# EasyEDA Pro project LUME_PEN_EasyEDA_Project_V1.2_2026-06-28.epro, schematic Schematic4
Board Name: 03_Debug_Board; Create Date: 2026-05-27; Page Name: P1; Project Name: LUME; Schematic Name: Schematic4; Update Date: 2026-06-01; Company: EasyEDA.com; Page Size: A4; Version: V1.0
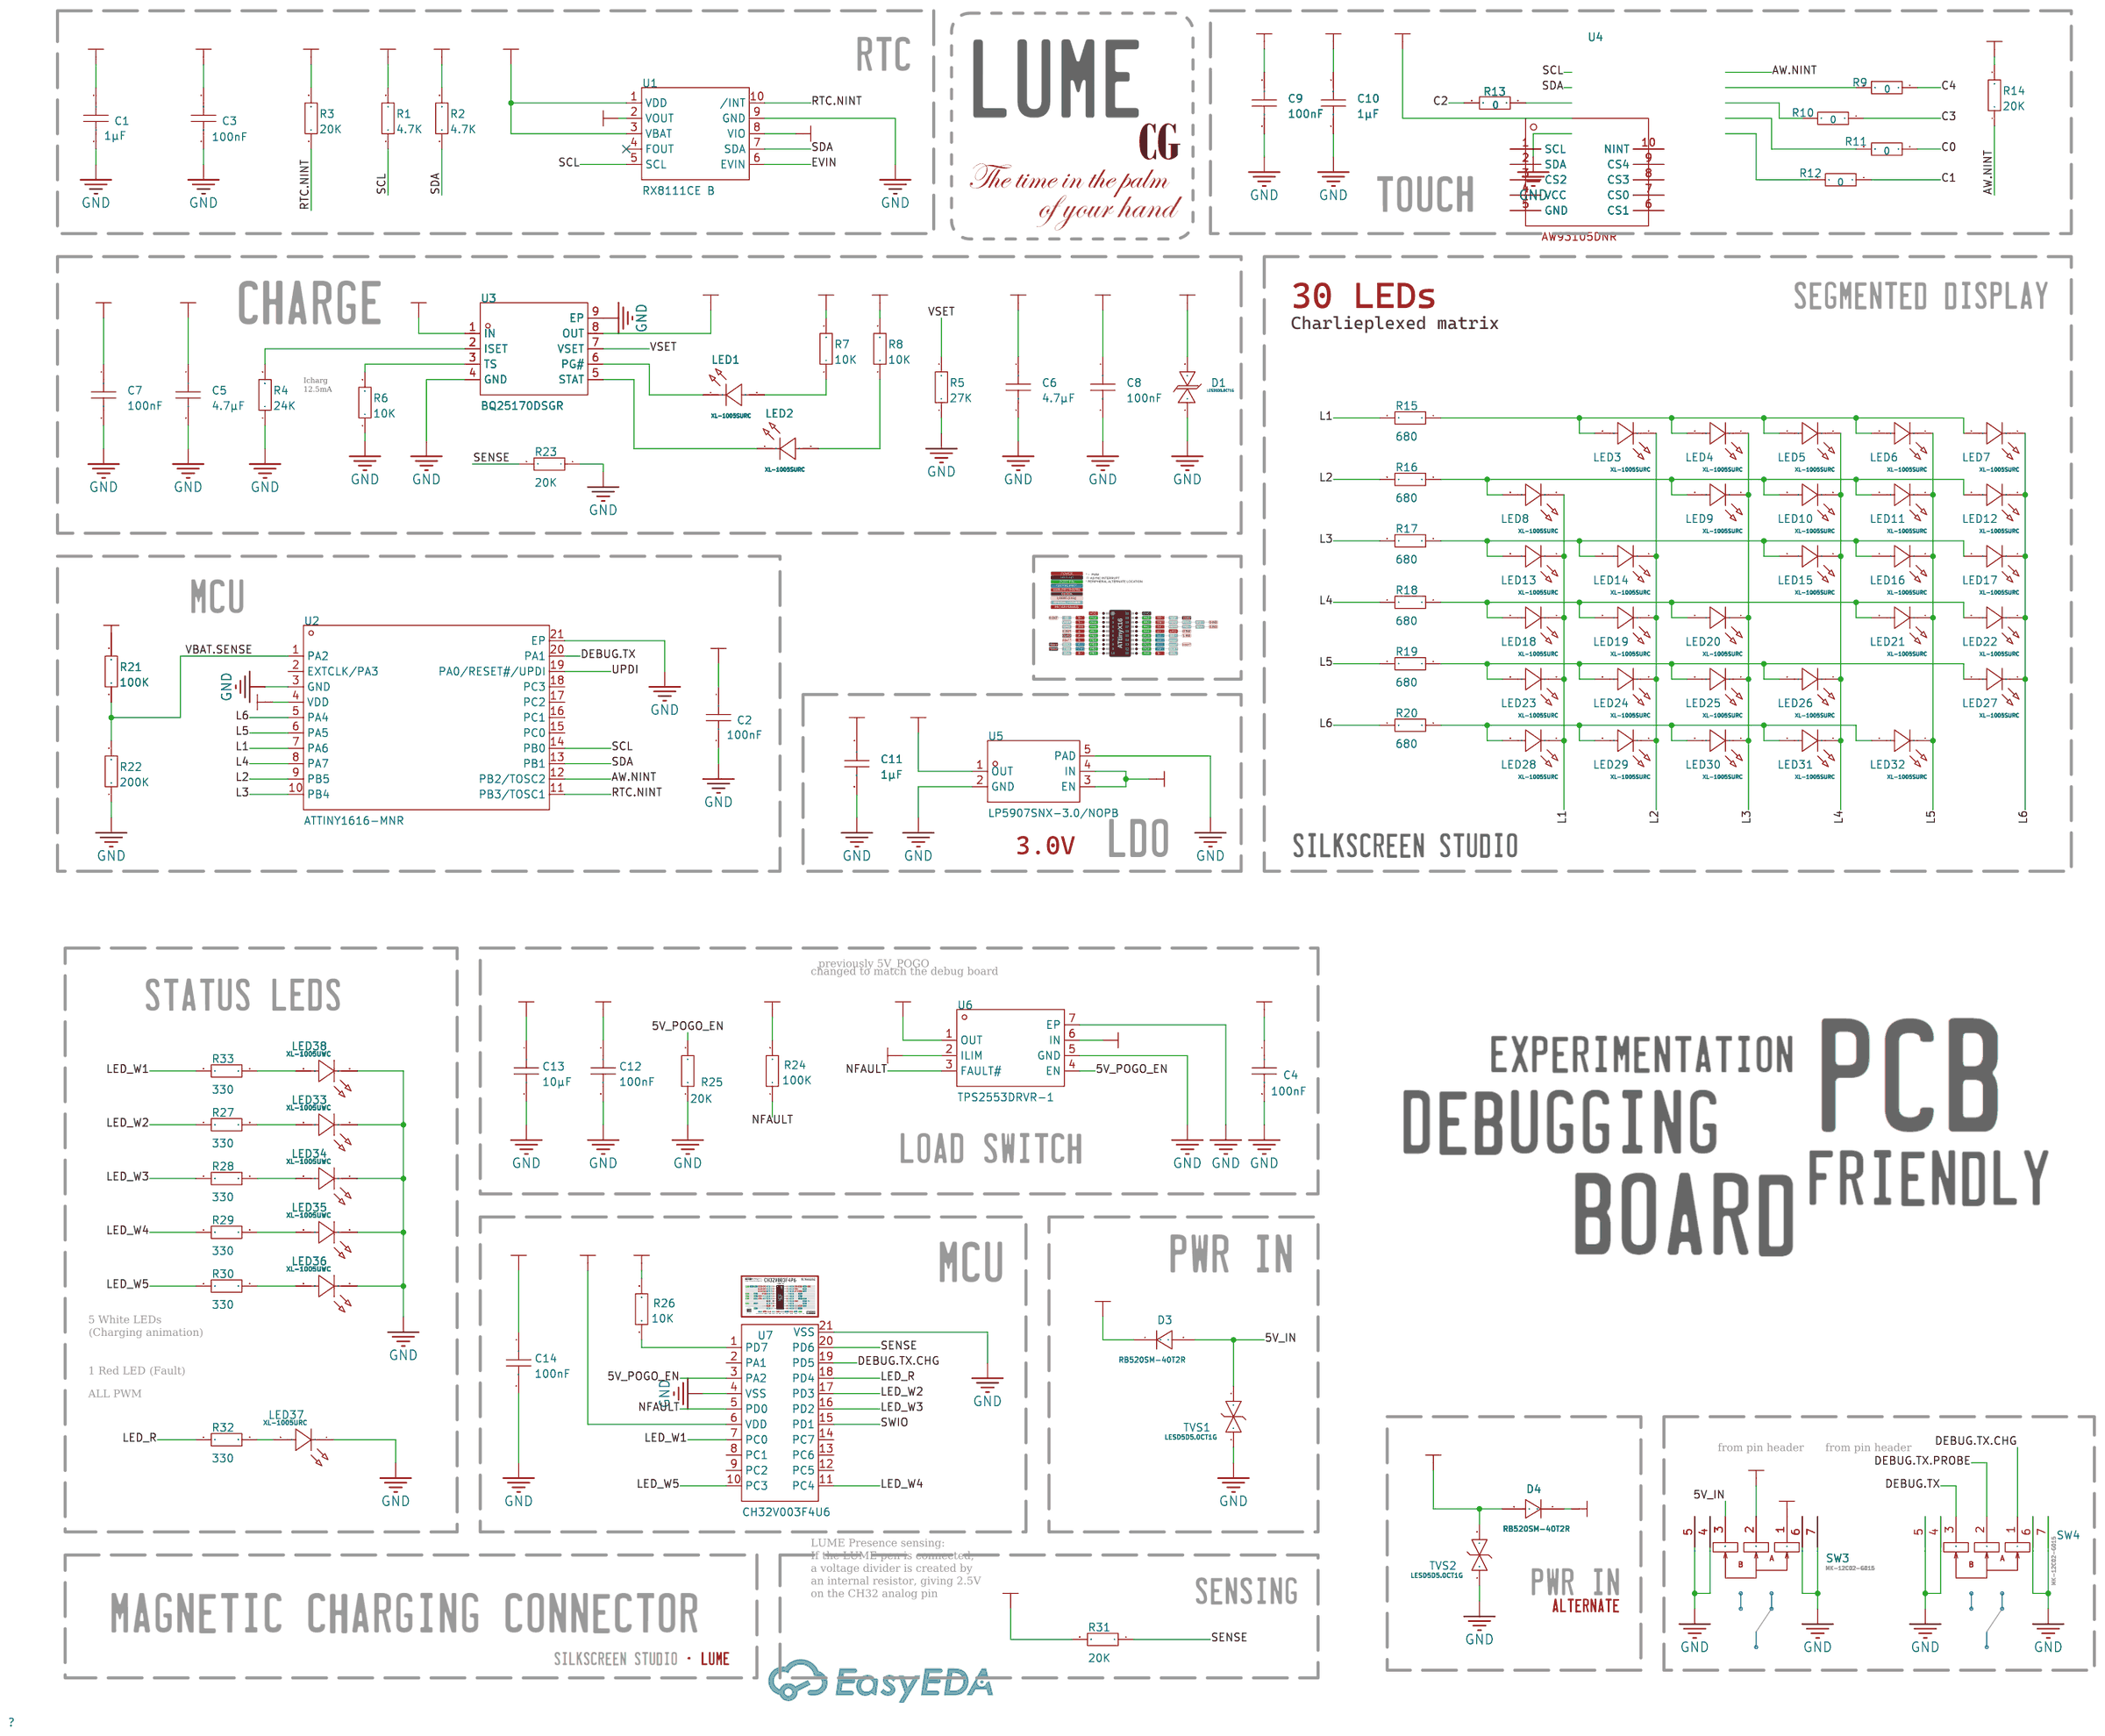
[diagram p0: schematic sheet]

## Parts
C1  1µF  [C0402]
C2  100nF  [C0402]
C3  100nF  [C0402]
C4  100nF  [C0402]
C5  4.7µF  [C0402]
C6  4.7µF  [C0402]
C7  100nF  [C0402]
C8  100nF  [C0402]
C9  100nF  [C0402]
C10  1µF  [C0402]
C11  1µF  [C0402]
C12  100nF  [C0402]
C13  10µF  [C0402]
C14  100nF  [C0402]
D1  LESD5D5.0CT1G  [SOD-523_L1.2-W0.8-LS1.6-BI]
D3  RB520SM-40T2R  [SOD-523F_L1.7-W0.9-LS1.7-RD]
D4  RB520SM-40T2R  [SOD-523F_L1.7-W0.9-LS1.7-RD]
LED1  XL-1005SURC  [LED0402]
LED2  XL-1005SURC  [LED0402]
LED3  XL-1005SURC  [LED0402]
LED4  XL-1005SURC  [LED0402]
LED5  XL-1005SURC  [LED0402]
LED6  XL-1005SURC  [LED0402]
LED7  XL-1005SURC  [LED0402]
LED8  XL-1005SURC  [LED0402]
LED9  XL-1005SURC  [LED0402]
LED10  XL-1005SURC  [LED0402]
LED11  XL-1005SURC  [LED0402]
LED12  XL-1005SURC  [LED0402]
LED13  XL-1005SURC  [LED0402]
LED14  XL-1005SURC  [LED0402]
LED15  XL-1005SURC  [LED0402]
LED16  XL-1005SURC  [LED0402]
LED17  XL-1005SURC  [LED0402]
LED18  XL-1005SURC  [LED0402]
LED19  XL-1005SURC  [LED0402]
LED20  XL-1005SURC  [LED0402]
LED21  XL-1005SURC  [LED0402]
LED22  XL-1005SURC  [LED0402]
LED23  XL-1005SURC  [LED0402]
LED24  XL-1005SURC  [LED0402]
LED25  XL-1005SURC  [LED0402]
LED26  XL-1005SURC  [LED0402]
LED27  XL-1005SURC  [LED0402]
LED28  XL-1005SURC  [LED0402]
LED29  XL-1005SURC  [LED0402]
LED30  XL-1005SURC  [LED0402]
LED31  XL-1005SURC  [LED0402]
LED32  XL-1005SURC  [LED0402]
LED33  XL-1005UWC  [LED0402-RD_YELLOW]
LED34  XL-1005UWC  [LED0402-RD_YELLOW]
LED35  XL-1005UWC  [LED0402-RD_YELLOW]
LED36  XL-1005UWC  [LED0402-RD_YELLOW]
LED37  XL-1005URC  [LED0402-RD_YELLOW]
LED38  XL-1005UWC  [LED0402-RD_YELLOW]
R1  4.7K  [R0402]
R2  4.7K  [R0402]
R3  20K  [R0402]
R4  24K  [R0402]
R5  27K  [R0402]
R6  10K  [R0402]
R7  10K  [R0402]
R8  10K  [R0402]
R9  0  [R0402]
R10  0  [R0402]
R11  0  [R0402]
R12  0  [R0402]
R13  0  [R0402]
R14  20K  [R0402]
R15  680  [R0402]
R16  680  [R0402]
R17  680  [R0402]
R18  680  [R0402]
R19  680  [R0402]
R20  680  [R0402]
R21  100K  [R0402]
R22  200K  [R0402]
R23  20K  [R0402]
R24  100K  [R0402]
R25  20K  [R0402]
R26  10K  [R0402]
R27  330  [R0402]
R28  330  [R0402]
R29  330  [R0402]
R30  330  [R0402]
R31  20K  [R0402]
R32  330  [R0402]
R33  330  [R0402]
SW3  MK-12C02-G015  [SW-SMD_G-SWITCH_MK-12C02-G015]
SW4  MK-12C02-G015  [SW-SMD_G-SWITCH_MK-12C02-G015]
TVS1  LESD5D5.0CT1G  [SOD-523_L1.2-W0.8-LS1.6-BI]
TVS2  LESD5D5.0CT1G  [SOD-523_L1.2-W0.8-LS1.6-BI]
U1  RX8111CE B  [OSC-SMD_10P-L3.2-W2.5-BL-1]
U2  ATTINY1616-MNR  [QFN-20_L3.0-W3.0-P0.40-BL-EP1.7]
U3  BQ25170DSGR  [WSON-8_L2.0-W2.0-P0.50-TL-EP]
U4  -  [AW93105DNR]
U5  LP5907SNX-3.0/NOPB  [X2SON-4_L1.0-W1.0-P0.65-BL-EP]
U6  TPS2553DRVR-1  [WSON-6_L2.0-W2.0-P0.65-BL-EP]
U7  CH32V003F4U6  [QFN-20_L3.0-W3.0-P0.40-TL-EP1.7]

## Library data of the parts
C1-C14 = CAP_0402: Supplier Part: C1525; Supplier Footprint: 0402
D1 = LESD5D5.0CT1G_C5199850: Supplier Part: C5199850; Manufacturer: UMW(友台半导体); Supplier Footprint: SOD-523; JLCPCB Part Class: Extended Part; Datasheet: https://atta.szlcsc.com/upload/public/pdf/source/20231109/3A3F4A5EA6FBA8B622F70BA286F4E0C0.pdf; Supplier: LCSC
D3 D4 = RB520SM-40T2R: Voltage - Forward(Vf@If):550mV@100mA Voltage - DC Reverse(Vr):40V Current - Rectified:200mA Reverse Leakage Current (Ir):10uA@40V Non-Repetitive Peak Forward Surge Current:1A; LCSC Part Name: 电压:40V 电流:200mA; Supplier Part: C253514; Manufacturer: ROHM(罗姆); Supplier Footprint: SOD-523; JLCPCB Part Class: Extended Part; Datasheet: https://item.szlcsc.com/datasheet/RB520SM-40T2R/248204.html; Supplier: LCSC; Voltage - Forward(Vf@If): 550mV@100mA; Voltage - DC Reverse(Vr): 40V; Current - Rectified: 200mA; Reverse Leakage Current (Ir): 10uA@40V; Non-Repetitive Peak Forward Surge Current: 1A
LED1-LED32 = XL-1005SURC_C25503345: Illumination Color:Red Voltage - Forward(Vf):1.8V~2.4V Voltage - Forward(Vf):1.8V~2.4V Power(Watts):50mW Forward Current:20mA Wavelength - Dominant:615nm~630nm Wavelength - Dominant:615nm~630nm Peak Wavelength:625nm Luminous Intensity:200mcd Luminous Inte; LCSC Part Name: 0402分光红贴片式发光二极管; Supplier Part: C25503345; Manufacturer: XINGLIGHT(成兴光); Supplier Footprint: 0402; JLCPCB Part Class: Extended Part; Datasheet: https://item.szlcsc.com/datasheet/XL-1005SURC/27234956.html; Supplier: LCSC; Illumination Color: Red; Voltage - Forward(Vf): 1.8V~2.4V; Power(Watts): 50mW; Forward Current: 20mA; Wavelength - Dominant: 615nm~630nm; Peak Wavelength: 625nm; Luminous Intensity: 200mcd; Viewing Angle: 120°; Operating Temperature: -40℃~+85℃
LED33-LED38 = XL-1005UWC_C20613596: Lamp Holder Type:- Illumination Color:White Voltage - Forward(Vf):2.8V Voltage - Forward(Vf):2.8V Power(Watts):75mW Forward Current:5mA Wavelength - Dominant:- Wavelength - Dominant:- Peak Wavelength:- Diode Configuration:Discrete Diode Lens Color:Yellow; LCSC Part Name: 0402冷白光贴片式发光二极管; Supplier Part: C20613596; Manufacturer: XINGLIGHT(成兴光); Supplier Footprint: 0402; JLCPCB Part Class: Extended Part; Datasheet: https://item.szlcsc.com/datasheet/XL-1005UWC/21979587.html; Supplier: LCSC; Illumination Color: White; Voltage - Forward(Vf): 2.8V; Power(Watts): 75mW; Forward Current: 5mA; Diode Configuration: Discrete Diode; Lens Color: Yellow Lens; Color Temperature: 15000K; Luminous Intensity: 1cd; Viewing Angle: 120°; Mounting Style: Top-mount; Operating Temperature: -40℃~+85℃
R1-R33 = Res_0402: Supplier Footprint: 0402
SW3 SW4 = MK-12C02-G015_C2911519: Circuit:SPDT Actuator Style:Rectangular Columnar Termination Style:- Length:6.6mm Width:1.4mm Switch Height:4.2mm Mounting Type:Surface Mount, Right Angle Actuator Color:Black Current Rating:1A Voltage Rating:6V Life:10,000 Cycles Operating Temperature:-2; LCSC Part Name: 七脚贴片微型拨动开关 G1.5; Supplier Part: C2911519; Manufacturer: G-Switch(品赞); Supplier Footprint: SMD,6.6x1.4mm; JLCPCB Part Class: Extended Part; Datasheet: https://item.szlcsc.com/datasheet/MK-12C02-G015/3191561.html; Supplier: LCSC; Circuit: SPDT; Actuator Style: Rectangular Columnar; Length: 6.6mm; Width: 1.4mm; Switch Height: 4.2mm; Mounting Type: Surface Mount, Right Angle; Actuator Color: Black; Current Rating: 1A; Voltage Rating: 6V; Life: 10,000 Cycles; Operating Temperature: -20℃~+70℃
TVS1 TVS2 = LESD5D5.0CT1G_C7433850: Polarity:- Reverse Stand-Off Voltage (Vrwm):5V Clamping Voltage:15V Peak Pulse Current (Ipp):5A Peak Pulse Power Dissipation (Ppp):75W Voltage - Breakdown:9V Reverse Leakage Current (Ir):1uA Number of Channels:1.0 Operating Temperature:-40℃~+150℃ Operatin; Supplier Part: C7433850; Manufacturer: KUU; Supplier Footprint: SOD-523; JLCPCB Part Class: Extended Part; Datasheet: https://item.szlcsc.com/datasheet/LESD5D5.0CT1G/8442902.html; Supplier: LCSC; Reverse Stand-Off Voltage (Vrwm): 5V; Clamping Voltage: 15V; Peak Pulse Current (Ipp): 5A; Peak Pulse Power Dissipation (Ppp): 75W; Voltage - Breakdown: 9V; Reverse Leakage Current (Ir): 1uA; Number of Channels: 1.0; Operating Temperature: -40℃~+150℃; level of protection: IEC 61000-4-2；IEC 61000-4-4; Type: ESD; Junction Capacitance: 15pF
U1 = RX8111CE B: Supplier Part: C2929261; Manufacturer: EPSON(爱普生); Supplier Footprint: SMD,3.2x2.5mm; JLCPCB Part Class: Extended Part; Datasheet: https://item.szlcsc.com/datasheet/RX8111CE%2520B/3261824.html; Supplier: LCSC
U2 = ATTINY1616-MNR: CPU Core:AVR CPU Maximum Speed:20MHz Program Storage Size:16KB Program Memory Type:FLASH Number of I/O:18 ADC (Bit):10bit DAC (Bit):8bit Voltage - Supply:1.8V~5.5V Voltage - Supply:1.8V~5.5V Applications:-; LCSC Part Name: tinyAVR 1系列处理器; Supplier Part: C507118; Manufacturer: MICROCHIP(美国微芯); Supplier Footprint: QFN-20-EP(3x3); JLCPCB Part Class: Extended Part; Datasheet: https://item.szlcsc.com/datasheet/ATTINY1616-MNR/520766.html; Supplier: LCSC; CPU Core: AVR; CPU Maximum Speed: 20MHz; Program Storage Size: 16KB; Program Memory Type: FLASH; Number of I/O: 18; ADC (Bit): 10bit; DAC (Bit): 8bit; Voltage - Supply: 1.8V~5.5V
U3 = BQ25170DSGR: The Chip Type:Charging IC Voltage - Supply:6.6V Voltage - Supply:6.6V Charge Current - Max:800mA Type of Battery:Lithium Battery；LiFePO4 Battery Number of Cells:1 Number of Cells:1 Operating Temperature:-40℃~+125℃ Operating Temperature:-40℃~+125℃ Battery; LCSC Part Name: 线性电池充电器; Supplier Part: C5208201; Manufacturer: TI(德州仪器); Supplier Footprint: WSON-8(2x2); JLCPCB Part Class: Extended Part; Datasheet: https://www.ti.com.cn/cn/lit/ds/symlink/bq25170.pdf?ts=1739415274024&ref_url=https%253A%252F%252Fwww.ti.com.cn%252Fproduct%252Fcn%252FBQ25170; Supplier: LCSC; The Chip Type: Charging IC; Voltage - Supply: 6.6V; Charge Current - Max: 800mA; Type of Battery: Lithium Battery；LiFePO4 Battery; Number of Cells: 1; Operating Temperature: -40℃~+125℃; Battery Temperature Detection: Support; Supply Current (Iq): 350nA
U4 = AW93105DNR: 5 channel Capacitive sensing
U5 = LP5907SNX-3.0/NOPB: Output Type:Fixed Maximum Input Voltage:5.5V Output Voltage:3V Output Voltage:3V Output Current:250mA Power Supply Rejection Ratio (PSRR):90dB@(100Hz)；60dB@(100kHz) Dropout Voltage:250mV@(250mA) Feature:ESD Protection；Short-Circuit  Protection；Low ESR；The; LCSC Part Name: 具有低 IQ 和使能功能的 250mA、低噪声、高 PSRR、超低压降稳压器; Supplier Part: C182423; Manufacturer: TI(德州仪器); Supplier Footprint: X2-SON-4-EP(1x1); JLCPCB Part Class: Extended Part; Datasheet: https://www.ti.com/cn/lit/gpn/lp5907; Supplier: LCSC; Output Type: Fixed; Maximum Input Voltage: 5.5V; Output Voltage: 3V; Output Current: 250mA; Power Supply Rejection Ratio (PSRR): 90dB@(100Hz)；60dB@(100kHz); Dropout Voltage: 250mV@(250mA); Feature: ESD Protection；Short-Circuit  Protection；Low ESR；Thermal Protection(TSD)；Under-voltage Lockout；With ability; Output Polarity: Positive electrode; Number of Outputs: 1
U6 = TPS2553DRVR-1: Type:Load Switch Number of Channels:1 Control Input Logic:Active High Maximum Continuous Current:1.5A Voltage - Supply:2.5V~6.5V Voltage - Supply:2.5V~6.5V RDS(on):115mΩ Operating Temperature	-:-40℃~+105℃ Operating Temperature	-:-40℃~+105℃ Features:Overte; LCSC Part Name: 精密可调、带电流限制的电源分配开关; Supplier Part: C411878; Manufacturer: TI(德州仪器); Supplier Footprint: WSON-6-EP(2x2); JLCPCB Part Class: Extended Part; Datasheet: https://www.ti.com/cn/lit/gpn/tps2553-1; Supplier: LCSC; Type: Load Switch; Number of Channels: 1; Control Input Logic: Active High; Maximum Continuous Current: 1.5A; Voltage - Supply: 2.5V~6.5V; RDS(on): 115mΩ; Operating Temperature	-: -40℃~+105℃; Features: Overtemperature protection (OTP)；Overcurrent Protection(OCP)
U7 = CH32V003F4U6: CPU Core:RISC-V CPU Maximum Speed:48MHz Program Storage Size:16KB Number of I/O:18 Applications:-; LCSC Part Name: QingKe V2微处理器; Supplier Part: C5299908; Manufacturer: WCH(南京沁恒); Supplier Footprint: QFN-20(3X3); JLCPCB Part Class: Extended Part; Datasheet: https://item.szlcsc.com/datasheet/CH32V003F4U6/6049934.html; Supplier: LCSC; CPU Core: RISC-V; CPU Maximum Speed: 48MHz; Program Storage Size: 16KB; Number of I/O: 18

## Nets
3.0V: C2.1 C3.1 C9.1 C10.1 C11.1 R1.2 R2.2 R3.2 R14.2 U1.1(VDD) U1.3(VBAT) U1.8(VIO) U2.4(VDD) U5.1(OUT)
5V_IN: D3.2(A) SW3.3 TVS1.2
5V_POGO_EN: R25.2 U6.4(EN) U7.3(PA2)
GND: C1.2 C2.2 C3.2 C4.2 C5.2 C6.2 C7.2 C8.2 C9.2 C10.2 C11.2 C12.2 C13.2 C14.2 D1.1 LED33.1(K) LED34.1(K) LED35.1(K) LED36.1(K) LED37.1(K) LED38.1(K) R4.1 R5.1 R6.1 R22.1 R23.1 R25.1 SW3.4 SW3.5 SW3.6 SW3.7 SW4.4 SW4.5 SW4.6 SW4.7 TVS1.1 TVS2.1 U1.9(GND) U2.3(GND) U2.21(EP) U3.4(GND) U3.9(EP) U5.2(GND) U5.5(PAD) U6.5(GND) U6.7(EP) U7.4(VSS) U7.21(VSS)
VBAT.SENSE: R21.1 R22.2 U2.1(PA2)
VBUS: C4.1 C12.1 C13.1 C14.1 D3.1(C) R24.2 R26.2 R31.2 U6.2(ILIM) U6.6(IN) U7.6(VDD)
VCC: C6.1 C8.1 D1.2 R7.2 R8.2 R21.2 U3.8(OUT) U5.3(EN) U5.4(IN)
VDD.DEBUG: SW3.2
VIN: C5.1 C7.1 D4.1(C) U3.1(IN) U6.1(OUT)
VIN.USB: D4.2(A) SW3.1 TVS2.2
AW.NINT: R14.1 U2.12(PB2/TOSC2)
C0: R11.1
C1: R12.1
C2: R13.2
C3: R10.1
C4: R9.1
DEBUG.TX: SW4.3 U2.20(PA1)
DEBUG.TX.CHG: SW4.1 U7.19(PD5)
DEBUG.TX.PROBE: SW4.2
EVIN: U1.6(EVIN)
L1: LED8.1(K) LED13.1(K) LED18.1(K) LED23.1(K) LED28.1(K) R15.2 U2.7(PA6)
L2: LED3.1(K) LED14.1(K) LED19.1(K) LED24.1(K) LED29.1(K) R16.2 U2.9(PB5)
L3: LED4.1(K) LED9.1(K) LED20.1(K) LED25.1(K) LED30.1(K) R17.2 U2.10(PB4)
L4: LED5.1(K) LED10.1(K) LED15.1(K) LED26.1(K) LED31.1(K) R18.2 U2.8(PA7)
L5: LED6.1(K) LED11.1(K) LED16.1(K) LED21.1(K) LED32.1(K) R19.2 U2.6(PA5)
L6: LED7.1(K) LED12.1(K) LED17.1(K) LED22.1(K) LED27.1(K) R20.2 U2.5(PA4)
LED_R: R32.1 U7.18(PD4)
LED_W1: R33.1 U7.7(PC0)
LED_W2: R27.1 U7.17(PD3)
LED_W3: R28.1 U7.16(PD2)
LED_W4: R29.1 U7.11(PC4)
LED_W5: R30.1 U7.10(PC3)
NFAULT: R24.1 U6.3(FAULT#) U7.5(PD0)
RTC.NINT: R3.1 U1.10(/INT) U2.11(PB3/TOSC1)
RTC.VOUT: C1.1 U1.2(VOUT)
SCL: R1.1 U1.5(SCL) U2.14(PB0)
SDA: R2.1 U1.7(SDA) U2.13(PB1)
SENSE: R23.2 R31.1 U7.20(PD6)
SWIO: U7.15(PD1)
UPDI: U2.19(PA0/RESET#/UPDI)
VSET: R5.2 U3.7(VSET)
$1N3166: R4.2 U3.2(ISET)
$1N3167: R6.2 U3.3(TS)
$1N3187: LED2.2(A) R8.1
$1N3197: LED2.1(K) U3.5(STAT)
$1N3198: LED1.2(A) R7.1
$1N3199: LED1.1(K) U3.6(PG#)
$1N4483: R26.1 U7.1(PD7)
$1N4489: LED38.2(A) R33.2
$1N4492: LED33.2(A) R27.2
$1N4495: LED34.2(A) R28.2
$1N4498: LED35.2(A) R29.2
$1N4501: LED36.2(A) R30.2
$1N4505: LED37.2(A) R32.2
$1N4813: LED3.2(A) LED4.2(A) LED5.2(A) LED6.2(A) LED7.2(A) R15.1
$1N4816: LED8.2(A) LED9.2(A) LED10.2(A) LED11.2(A) LED12.2(A) R16.1
$1N4817: LED18.2(A) LED19.2(A) LED20.2(A) LED21.2(A) LED22.2(A) R18.1
$1N4818: LED13.2(A) LED14.2(A) LED15.2(A) LED16.2(A) LED17.2(A) R17.1
$1N4825: LED23.2(A) LED24.2(A) LED25.2(A) LED26.2(A) LED27.2(A) R19.1
$1N5378: LED28.2(A) LED29.2(A) LED30.2(A) LED31.2(A) LED32.2(A) R20.1

Not connected (* = marked no-connect by the designer): R9 2; R10 2; R11 2; R12 2; R13 1; U1 4(FOUT)*; U2 2(EXTCLK/PA3) 15(PC0) 16(PC1) 17(PC2) 18(PC3); U4 1(SCL) 2(SDA) 3(CS2) 4(VCC) 5(GND) 6(CS1) 7(CS0) 8(CS3) 9(CS4) 10(NINT); U7 2(PA1) 8(PC1) 9(PC2) 12(PC5) 13(PC6) 14(PC7)

## Notes on the sheet
- Icharg
  12.5mA
- changed to match the debug board
- previously 5V_POGO
- 5 White LEDs
  (Charging animation)
- 1 Red LED (Fault)
- ALL PWM
- from pin header
- from pin header
- LUME Presence sensing:
  If the LUME pen is connected,
  a voltage divider is created by
  an internal resistor, giving 2.5V
  on the CH32 analog pin
